# Altium project LiFePO4 Fuel Gauge.PrjPcb
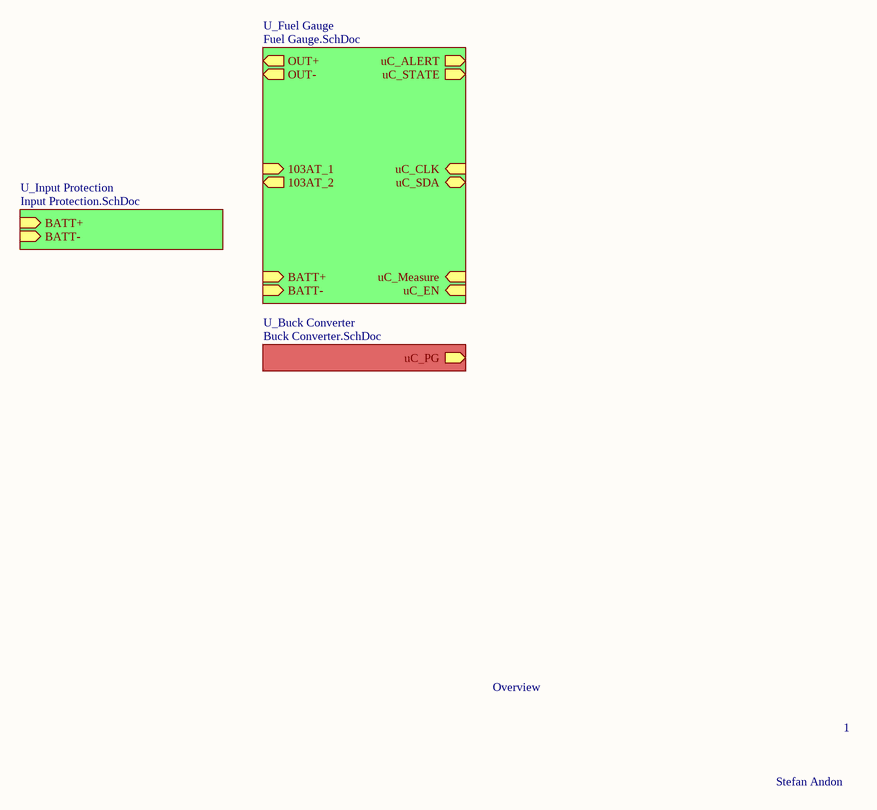
[diagram p0: Overview.SchDoc]
3 sheets, 55 parts. Net scope: hierarchical (ports join the sheet entries above them; power ports are global).
Sheets:
  Overview.SchDoc
    U_Fuel Gauge = Fuel Gauge.SchDoc
    U_Buck Converter = Buck Converter.SchDoc

## Sheet Overview.SchDoc
size A; SheetNumber: 1; SheetTotal: 4

### Sub-sheets
U_Buck Converter = Buck Converter.SchDoc: uC_PG (out)
U_Fuel Gauge = Fuel Gauge.SchDoc: OUT- (out), BATT- (in), BATT+ (in), OUT+ (out), 103AT_1 (in), 103AT_2 (out), uC_ALERT (out), uC_STATE (out), uC_EN (in), uC_Measure (in), uC_SDA (bidir), uC_CLK (in)
U_Input Protection = Input Protection.SchDoc (file not in this document): BATT+ (in), BATT- (in)

### Nets
BATT+: sheet U_Fuel Gauge/BATT+, sheet U_Fuel Gauge/OUT+

### Notes on the sheet
- Overview
- 1
- Stefan Andon

## Sheet Fuel Gauge.SchDoc
size A4; SheetNumber: 2; SheetTotal: 3
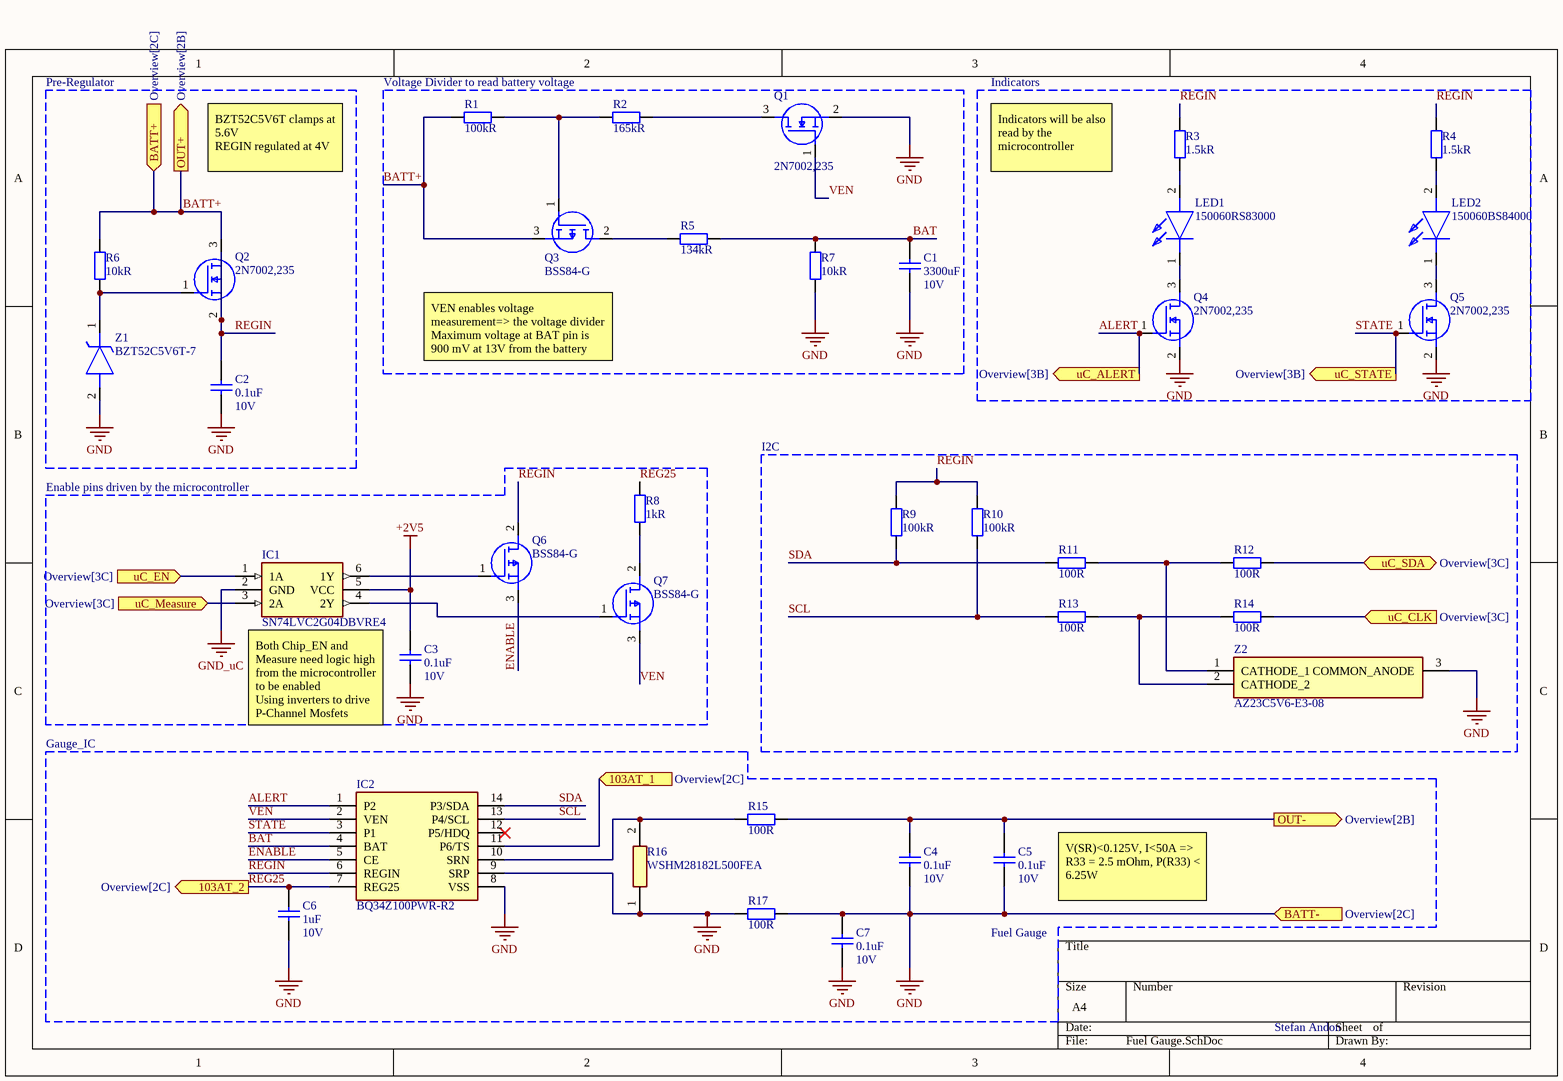
[diagram p1: Fuel Gauge.SchDoc]

### Parts
C1  value 3300uF  Voltage: 10V  [CAP_0603]  (hidden comment: Capacitor_SMD)
C2  value 0.1uF  Voltage: 10V  [CAP_0603]  (hidden comment: Capacitor_SMD)
C3  value 0.1uF  Voltage: 10V  [CAP_0603]  (hidden comment: Capacitor_SMD)
C4  value 0.1uF  Voltage: 10V  [CAP_0603]  (hidden comment: Capacitor_SMD)
C5  value 0.1uF  Voltage: 10V  [CAP_0603]  (hidden comment: Capacitor_SMD)
C6  value 1uF  Voltage: 10V  [CAP_0603]  (hidden comment: Capacitor_SMD)
C7  value 0.1uF  Voltage: 10V  [CAP_0603]  (hidden comment: Capacitor_SMD)
IC1  SN74LVC2G04DBVRE4  [SOT95P280X145-6N]
IC2  BQ34Z100PWR-R2  [SOP65P640X120-14N]
LED1  150060RS83000  [LEDC1608X115N]
LED2  150060BS84000  [LEDC1608X105N]
Q1  2N7002,235  [SOT95P230X110-3N]
Q2  2N7002,235  [SOT95P230X110-3N]
Q3  BSS84-G  [SOT95P240X120-3N]
Q4  2N7002,235  [SOT95P230X110-3N]
Q5  2N7002,235  [SOT95P230X110-3N]
Q6  BSS84-G  [SOT95P240X120-3N]
Q7  BSS84-G  [SOT95P240X120-3N]
R1  value 100kR  [RES_1206]  (hidden comment: Resistor_SMD)
R2  value 165kR  [RES_1206]  (hidden comment: Resistor_SMD)
R3  value 1.5kR  [RES_1206]  (hidden comment: Resistor_SMD)
R4  value 1.5kR  [RES_1206]  (hidden comment: Resistor_SMD)
R5  value 134kR  [RES_1206]  (hidden comment: Resistor_SMD)
R6  value 10kR  [RES_1206]  (hidden comment: Resistor_SMD)
R7  value 10kR  [RES_1206]  (hidden comment: Resistor_SMD)
R8  value 1kR  [RES_1206]  (hidden comment: Resistor_SMD)
R9  value 100kR  [RES_1206]  (hidden comment: Resistor_SMD)
R10  value 100kR  [RES_1206]  (hidden comment: Resistor_SMD)
R11  value 100R  [RES_1206]  (hidden comment: Resistor_SMD)
R12  value 100R  [RES_1206]  (hidden comment: Resistor_SMD)
R13  value 100R  [RES_1206]  (hidden comment: Resistor_SMD)
R14  value 100R  [RES_1206]  (hidden comment: Resistor_SMD)
R15  value 100R  [RES_1206]  (hidden comment: Resistor_SMD)
R16  WSHM28182L500FEA  [WSHM28182L500FEA]
R17  value 100R  [RES_1206]  (hidden comment: Resistor_SMD)
Z1  BZT52C5V6T-7  [BZT52C5V6T7]
Z2  AZ23C5V6-E3-08  [SOT95P248X115-3N]

### Blocks framed on the sheet
Pre-Regulator: C2 Q2 R6 Z1
Voltage Divider to read battery voltage: C1 Q1 Q3 R1 R2 R5 R7
Indicators: LED1 LED2 Q4 Q5 R3 R4
I2C: R9-R14 Z2

### Ports
103AT_1 (in, see Overview[2C]), 103AT_2 (out, see Overview[2C]), BATT+ (in, see Overview[2C]), BATT- (in, see Overview[2C]), OUT+ (out, see Overview[2B]), OUT- (out, see Overview[2B]), uC_ALERT (out, see Overview[3B]), uC_CLK (in, see Overview[3C]), uC_EN (in, see Overview[3C]), uC_Measure (in, see Overview[3C]), uC_SDA (bidir, see Overview[3C]), uC_STATE (out, see Overview[3B])

### Nets
+2V5: C3.2 IC1.5(VCC)
GND: C1.1 C2.1 C3.1 C4.1 C5.1 C6.1 C7.1 C7.2 IC2.8(VSS) IC2.9(SRP) Q1.2(S) Q4.2(S) Q5.2(S) R7.1 R16.1 R17.1 R17.2 Z1.2(A) Z2.3(COMMON_ANODE) ; port BATT-
GND_uC: IC1.2(GND)
ALERT: IC2.1(P2) Q4.1(G) ; port uC_ALERT
BAT: C1.2 IC2.4(BAT) R5.2 R7.2
BATT+: Q2.3(D) Q3.3(S) R1.1 R6.1 ; port BATT+, port OUT+
ENABLE: IC2.5(CE) Q6.3(S)
REG25: C6.2 IC2.7(REG25) R8.2 ; port 103AT_2
REGIN: C2.2 IC2.6(REGIN) Q2.2(S) Q6.2(D) R3.2 R4.2 R9.2 R10.2
SCL: IC2.13(P4/SCL) R10.1 R13.2
SDA: IC2.14(P3/SDA) R9.1 R11.2
STATE: IC2.3(P1) Q5.1(G) ; port uC_STATE
VEN: IC2.2(VEN) Q1.1(G) Q7.3(S)
NetC4_2: C4.2 C5.2 R15.1 ; port OUT-
NetIC1_1: IC1.1(1A) ; port uC_EN
NetIC1_3: IC1.3(2A) ; port uC_Measure
NetIC1_4: IC1.4(2Y) Q7.1(G)
NetIC1_6: IC1.6(1Y) Q6.1(G)
NetIC2_10: IC2.10(SRN) R15.2 R16.2
NetIC2_11: IC2.11(P6/TS) ; port 103AT_1
NetLED1_1: LED1.1(K) Q4.3(D)
NetLED1_2: LED1.2(A) R3.1
NetLED2_1: LED2.1(K) Q5.3(D)
NetLED2_2: LED2.2(A) R4.1
NetQ1_3: Q1.3(D) R2.2
NetQ2_1: Q2.1(G) R6.2 Z1.1(K)
NetQ3_1: Q3.1(G) R1.2 R2.1
NetQ3_2: Q3.2(D) R5.1
NetQ7_2: Q7.2(D) R8.1
NetR11_1: R11.1 R12.2 Z2.1(CATHODE_1)
NetR12_1: R12.1 ; port uC_SDA
NetR13_1: R13.1 R14.2 Z2.2(CATHODE_2)
NetR14_1: R14.1 ; port uC_CLK

Not connected (* = marked no-connect by the designer): IC2 12(P5/HDQ)*

### Notes on the sheet
- BZT52C5V6T clamps at 5.6V
  REGIN regulated at 4V
- Indicators will be also read by the microcontroller
- VEN enables voltage measurement=> the voltage divider
  Maximum voltage at BAT pin is 900 mV at 13V from the battery
- Enable pins driven by the microcontroller
- Gauge_IC
- Both Chip_EN and Measure need logic high from the microcontroller to be enabled
  Using inverters to drive P-Channel Mosfets
- V(SR)<0.125V, I<50A => R33 = 2.5 mOhm, P(R33) < 6.25W
- Fuel Gauge
- Stefan Andon

### Library data of the parts
C1 = CMP-001-0004-13: SMD Capacitor; Tolerance: tbd; BOM: 3300uF, 10V, tbd, tbd,CAP_0603; Dielectric: tbd; Package: tbd
C2-C5 C7 = CMP-001-0004-13: SMD Capacitor; Tolerance: tbd; BOM: 0.1uF, 10V, tbd, tbd,CAP_0603; Dielectric: tbd; Package: tbd
C6 = CMP-001-0004-13: SMD Capacitor; Tolerance: tbd; BOM: 1uF, 10V, tbd, tbd,CAP_0603; Dielectric: tbd; Package: tbd
IC1 = SN74LVC2G04DBVRE4: Integrated Circuit; Manufacturer_Name: Texas Instruments; Datasheet Link: https://www.arrow.com/en/products/sn74lvc2g04dbvre4/texas-instruments; Height: 1.45mm; Manufacturer_Part_Number: SN74LVC2G04DBVRE4; Mouser Part Number: 595-SN74LVC2G04DBVRE; Mouser Price/Stock: https://www.mouser.co.uk/ProductDetail/Texas-Instruments/SN74LVC2G04DBVRE4?qs=PVVDbbWpW3Jcz3iqyBLxqA%3D%3D; Arrow Part Number: SN74LVC2G04DBVRE4; Arrow Price/Stock: https://www.arrow.com/en/products/sn74lvc2g04dbvre4/texas-instruments?utm_currency=USD&region=nac
IC2 = BQ34Z100PWR-R2: Integrated Circuit; Manufacturer_Name: Texas Instruments; Datasheet Link: https://www.arrow.com/en/products/bq34z100pwr-r2/texas-instruments?region=nac; Height: 1.2mm; Manufacturer_Part_Number: BQ34Z100PWR-R2; Mouser Part Number: 595-BQ34Z100PWR-R2; Mouser Price/Stock: https://www.mouser.co.uk/ProductDetail/Texas-Instruments/BQ34Z100PWR-R2?qs=rQFj71Wb1eWspkgmxcmVcA%3D%3D; Arrow Part Number: BQ34Z100PWR-R2; Arrow Price/Stock: https://www.arrow.com/en/products/bq34z100pwr-r2/texas-instruments?utm_currency=USD&region=nac
LED1 = 150060RS83000: LED; Manufacturer_Name: Wurth Elektronik; Datasheet Link: https://www.mouser.com/datasheet/2/445/150060RS86000-1838740.pdf; Height: 1.15mm; Manufacturer_Part_Number: 150060RS83000
LED2 = 150060BS84000: LED; Manufacturer_Name: Wurth Elektronik; Datasheet Link: https://componentsearchengine.com/Datasheets/2/150060BS84000.pdf; Height: 1.05mm; Manufacturer_Part_Number: 150060BS84000; Mouser Part Number: 710-150060BS84000; Mouser Price/Stock: https://www.mouser.co.uk/ProductDetail/Wurth-Elektronik/150060BS84000?qs=GedFDFLaBXH%2FqfYoSeFEow%3D%3D
Q1 Q2 Q4 Q5 = 2N7002,235: MOSFET (N-Channel); Manufacturer_Name: Nexperia; Datasheet Link: https://assets.nexperia.com/documents/data-sheet/2N7002.pdf; Height: 1.1mm; Manufacturer_Part_Number: 2N7002,235; Mouser Part Number: 771-2N7002235; Mouser Price/Stock: https://www.mouser.co.uk/ProductDetail/Nexperia/2N7002235?qs=AX3SRYwdf7Gv59FeQZ%2FkYw%3D%3D; Arrow Part Number: 2N7002,235; Arrow Price/Stock: https://www.arrow.com/en/products/2n7002235/nexperia?utm_currency=USD&region=europe
Q3 Q6 Q7 = BSS84-G: MOSFET (P-Channel); Manufacturer_Name: onsemi; Datasheet Link: https://componentsearchengine.com/Datasheets/1/BSS84-G.pdf; Height: 1.2mm; Manufacturer_Part_Number: BSS84-G; Mouser Part Number: 863-BSS84-G; Mouser Price/Stock: https://www.mouser.co.uk/ProductDetail/onsemi/BSS84-G?qs=UkDUCjYnTB2fT1WGeui6RQ%3D%3D
R1-R15 R17 = CMP-001-0003-18: Tolerance: tbd; Power: 7W; BOM: Value+', '+Power+', '+Tolerance+', '+CurrentFootprint; Package: tbd
R16 = WSHM28182L500FEA: Resistor; Manufacturer_Name: Vishay; Datasheet Link: https://www.vishay.com/doc?30188; Height: 1.75mm; Manufacturer_Part_Number: WSHM28182L500FEA; Mouser Part Number: 71-WSHM28182L500FEA; Mouser Price/Stock: https://www.mouser.co.uk/ProductDetail/Vishay-Dale/WSHM28182L500FEA?qs=Blj4iBE%2FJuPIwDroY2n%2Fgg%3D%3D
Z1 = BZT52C5V6T-7: Zener Diode; Manufacturer_Name: Diodes Incorporated; Datasheet Link: https://www.diodes.com/datasheet/download/BZT52CxxT.pdf; Height: 0.65mm; Manufacturer_Part_Number: BZT52C5V6T-7; Mouser Part Number: 621-BZT52C5V6T-7; Mouser Price/Stock: https://www.mouser.co.uk/ProductDetail/Diodes-Incorporated/BZT52C5V6T-7?qs=zLeapIUCO8Tm%252BIuaCPAdkQ%3D%3D; Arrow Part Number: BZT52C5V6T-7; Arrow Price/Stock: https://www.arrow.com/en/products/bzt52c5v6t-7/diodes-incorporated?region=nac
Z2 = AZ23C5V6-E3-08: Zener Diode; Manufacturer_Name: Vishay; Datasheet Link: https://www.vishay.com/docs/85759/az23.pdf; Height: 1.15mm; Manufacturer_Part_Number: AZ23C5V6-E3-08; Mouser Part Number: 78-AZ23C5V6-E3-08; Mouser Price/Stock: https://www.mouser.co.uk/ProductDetail/Vishay-Semiconductors/AZ23C5V6-E3-08?qs=KP8Io%2FXyE5TgneZJwqz1XQ%3D%3D; Arrow Part Number: AZ23C5V6-E3-08; Arrow Price/Stock: https://www.arrow.com/en/products/az23c5v6-e3-08/vishay?utm_currency=USD&region=nac

## Sheet Buck Converter.SchDoc
size A4; SheetNumber: 4; SheetTotal: 4
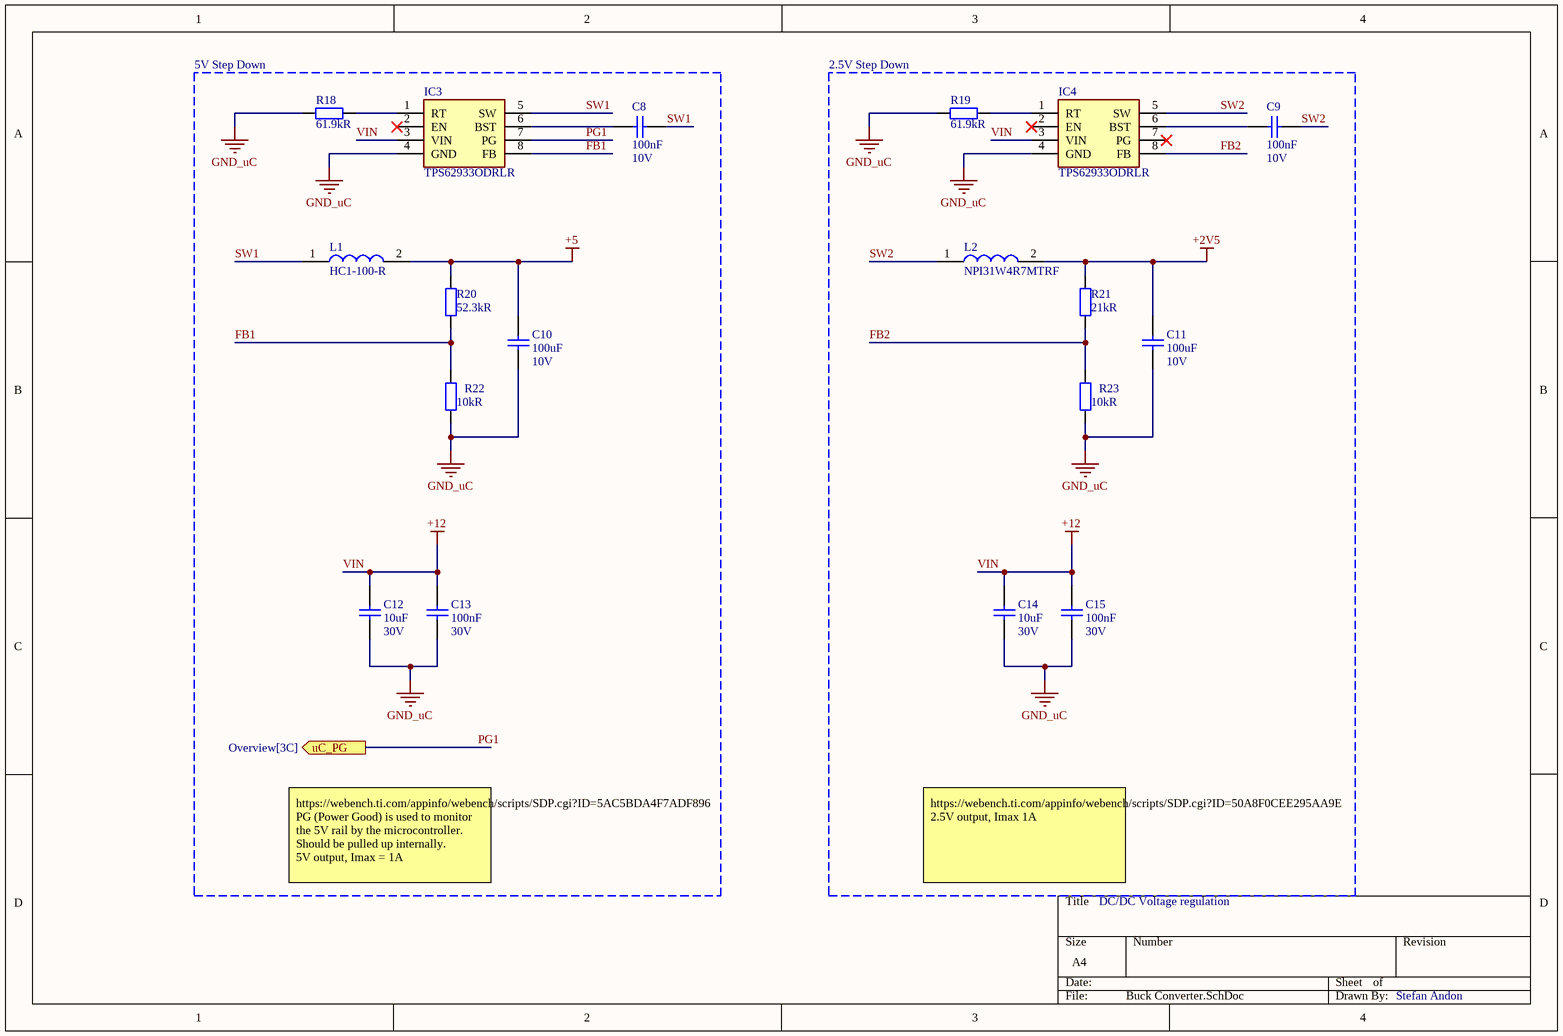
[diagram p2: Buck Converter.SchDoc]

### Parts
C8  value 100nF  Voltage: 10V  [CAP_0603]  (hidden comment: Capacitor_SMD)
C9  value 100nF  Voltage: 10V  [CAP_0603]  (hidden comment: Capacitor_SMD)
C10  value 100uF  Voltage: 10V  [CAP_0603]  (hidden comment: Capacitor_SMD)
C11  value 100uF  Voltage: 10V  [CAP_0603]  (hidden comment: Capacitor_SMD)
C12  value 10uF  Voltage: 30V  [CAP_0603]  (hidden comment: Capacitor_SMD)
C13  value 100nF  Voltage: 30V  [CAP_0603]  (hidden comment: Capacitor_SMD)
C14  value 10uF  Voltage: 30V  [CAP_0603]  (hidden comment: Capacitor_SMD)
C15  value 100nF  Voltage: 30V  [CAP_0603]  (hidden comment: Capacitor_SMD)
IC3  TPS62933ODRLR  [SOTFL50P160X60-8N]
IC4  TPS62933ODRLR  [SOTFL50P160X60-8N]
L1  HC1-100-R  [HC1100R]
L2  NPI31W4R7MTRF  [NPI31W4R7MTRF]
R18  value 61.9kR  [RES_1206]  (hidden comment: Resistor_SMD)
R19  value 61.9kR  [RES_1206]  (hidden comment: Resistor_SMD)
R20  value 52.3kR  [RES_1206]  (hidden comment: Resistor_SMD)
R21  value 21kR  [RES_1206]  (hidden comment: Resistor_SMD)
R22  value 10kR  [RES_1206]  (hidden comment: Resistor_SMD)
R23  value 10kR  [RES_1206]  (hidden comment: Resistor_SMD)

### Blocks framed on the sheet
5V Step Down: C8 C10 C12 C13 IC3 L1 R18 R20 R22
2.5V Step Down: C9 C11 C14 C15 IC4 L2 R19 R21 R23

### Ports
uC_PG (out, see Overview[3C])

### Nets
+2V5: C11.2 L2.2 R21.1
+5: C10.2 L1.2 R20.1
GND_uC: C10.1 C11.1 C12.1 C13.1 C14.1 C15.1 IC3.4(GND) IC4.4(GND) R18.1 R19.1 R22.2 R23.2
VIN: C12.2 C13.2 C14.2 C15.2 IC3.3(VIN) IC4.3(VIN)  [also labelled +12]
FB1: IC3.8(FB) R20.2 R22.1
FB2: IC4.8(FB) R21.2 R23.1
PG1: IC3.7(PG) ; port uC_PG
SW1: C8.1 IC3.5(SW) L1.1
SW2: C9.1 IC4.5(SW) L2.1
NetC8_2: C8.2 IC3.6(BST)
NetC9_2: C9.2 IC4.6(BST)
NetIC3_1: IC3.1(RT) R18.2
NetIC4_1: IC4.1(RT) R19.2

Not connected (* = marked no-connect by the designer): IC3 2(EN)*; IC4 2(EN)* 7(PG)*

### Notes on the sheet
- https://webench.ti.com/appinfo/webench/scripts/SDP.cgi?ID=5AC5BDA4F7ADF896
  PG (Power Good) is used to monitor the 5V rail by the microcontroller. Should be pulled up internally.
  5V output, Imax = 1A
- https://webench.ti.com/appinfo/webench/scripts/SDP.cgi?ID=50A8F0CEE295AA9E
  2.5V output, Imax 1A
- DC/DC Voltage regulation
- Stefan Andon

### Library data of the parts
C8 C9 = CMP-001-0004-13: SMD Capacitor; Tolerance: tbd; BOM: 100nF, 10V, tbd, tbd,CAP_0603; Dielectric: tbd; Package: tbd
C10 C11 = CMP-001-0004-13: SMD Capacitor; Tolerance: tbd; BOM: 100uF, 10V, tbd, tbd,CAP_0603; Dielectric: tbd; Package: tbd
C12 C14 = CMP-001-0004-13: SMD Capacitor; Tolerance: tbd; BOM: 10uF, 30V, tbd, tbd,CAP_0603; Dielectric: tbd; Package: tbd
C13 C15 = CMP-001-0004-13: SMD Capacitor; Tolerance: tbd; BOM: 100nF, 30V, tbd, tbd,CAP_0603; Dielectric: tbd; Package: tbd
IC3 IC4 = TPS62933ODRLR: Integrated Circuit; Manufacturer_Name: Texas Instruments; Datasheet Link: https://www.ti.com/lit/ds/symlink/tps62933o.pdf?ts=1692352588671&ref_url=https%253A%252F%252Fwww.ti.com%252Fproduct%252FTPS62933O%252Fpart-details%252FTPS62933ODRLR; Height: 0.6mm; Manufacturer_Part_Number: TPS62933ODRLR; Mouser Part Number: 595-TPS62933ODRLR; Mouser Price/Stock: https://www.mouser.co.uk/ProductDetail/Texas-Instruments/TPS62933ODRLR?qs=By6Nw2ByBD3VuSv7z7GudQ%3D%3D; Arrow Part Number: TPS62933ODRLR; Arrow Price/Stock: https://www.arrow.com/en/products/tps62933odrlr/texas-instruments?utm_currency=USD&region=nac
L1 = HC1-100-R: Inductor; Manufacturer_Name: Eaton; Datasheet Link: https://www.eaton.com/content/dam/eaton/products/electronic-components/resources/data-sheet/eaton-hc1-high-current-inductor-data-sheet.pdf; Height: 10mm; Manufacturer_Part_Number: HC1-100-R; Mouser Part Number: 704-HC1-100-R; Mouser Price/Stock: https://www.mouser.co.uk/ProductDetail/Eaton-Electronics/HC1-100-R?qs=yzwxPInThYSDEsv3O8Y5%252Bg%3D%3D; Arrow Part Number: HC1-100-R; Arrow Price/Stock: https://www.arrow.com/en/products/hc1-100-r/eaton?region=nac
L2 = NPI31W4R7MTRF: Inductor; Manufacturer_Name: NIC Components; Datasheet Link: https://datasheet.octopart.com/NPI31W4R7MTRF-NIC-Components-datasheet-11745383.pdf; Height: 5.3mm; Manufacturer_Part_Number: NPI31W4R7MTRF; Arrow Part Number: NPI31W4R7MTRF; Arrow Price/Stock: https://www.arrow.com/en/products/npi31w4r7mtrf/nic-components?region=nac
R18-R23 = CMP-001-0003-18: as R1 on sheet Fuel Gauge; Package: tbd

## Nets that join several sheets
+2V5: Fuel Gauge (C3.2 IC1.5), Buck Converter (C11.2 L2.2 R21.1)
GND_uC: Fuel Gauge (IC1.2), Buck Converter (12 pins)